# EAGLE design GPIO (EAGLE 9.0.0)
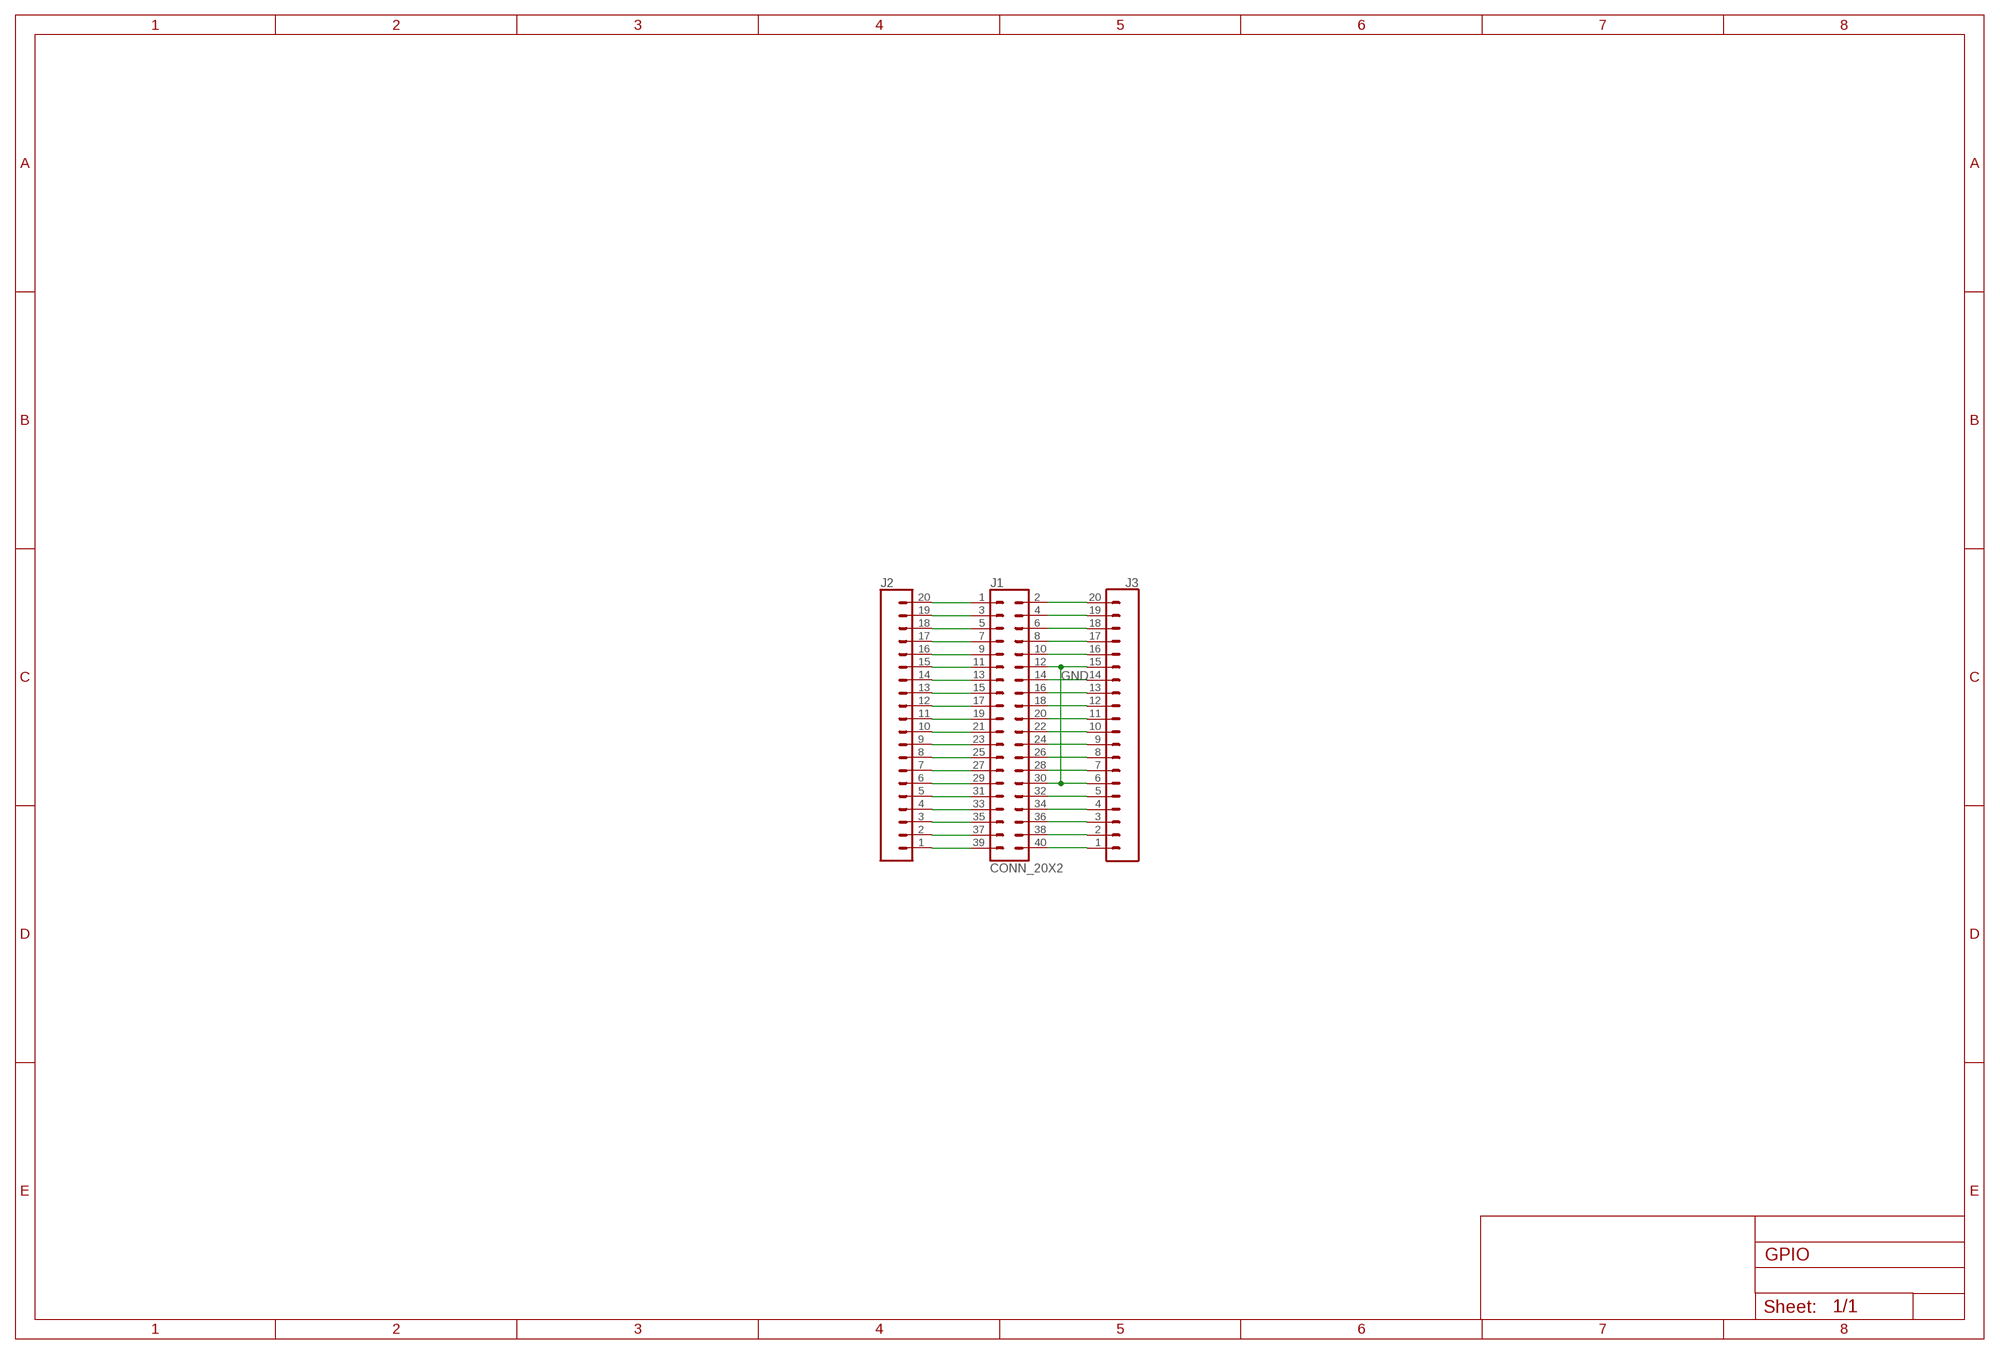
[diagram p0: schematic, sheet 1]

## Parts
J1  CONN_20X2  [2X20]
J2  CONN_20  [1X20]
J3  CONN_20  [1X20]

## Nets
GND: J1.12 J1.30 J3.6 J3.15
N$1: J1.40 J3.1
N$2: J1.38 J3.2
N$3: J1.36 J3.3
N$4: J1.34 J3.4
N$5: J1.32 J3.5
N$7: J1.28 J3.7
N$8: J1.26 J3.8
N$9: J1.24 J3.9
N$10: J1.22 J3.10
N$11: J1.20 J3.11
N$12: J1.18 J3.12
N$13: J1.16 J3.13
N$14: J1.14 J3.14
N$16: J1.10 J3.16
N$17: J1.8 J3.17
N$18: J1.6 J3.18
N$19: J1.4 J3.19
N$20: J1.2 J3.20
N$21: J1.39 J2.1
N$22: J1.37 J2.2
N$23: J1.35 J2.3
N$24: J1.33 J2.4
N$25: J1.31 J2.5
N$26: J1.29 J2.6
N$27: J1.27 J2.7
N$28: J1.25 J2.8
N$29: J1.23 J2.9
N$30: J1.21 J2.10
N$31: J1.19 J2.11
N$32: J1.17 J2.12
N$33: J1.15 J2.13
N$34: J1.13 J2.14
N$35: J1.11 J2.15
N$36: J1.9 J2.16
N$37: J1.7 J2.17
N$38: J1.5 J2.18
N$39: J1.3 J2.19
N$40: J1.1 J2.20

## Library data of the parts
J1 = SparkFun-Connectors:CONN_20X2: Multi connection point. Often used as Generic Header-pin footprint for 0.1 inch spaced/style header connections On any of the 0.1 inch spaced packages, you can populate with these: Break Away Headers - Straight <https://www.sparkfun.com/products/116> (PRT-00116) Break Away Male Headers - Right Angle <https://www.sparkfun.com/products/553> (PRT-00553) Female Headers <https://www.sparkfun.com/products/115> (PRT-00115) Break Away Headers - Machine Pin <https://www.sparkfun.com/products/117> (PRT-00117) Break Away Female Headers - Swiss Machine Pin <https://www.sparkfun.com/products/743> (PRT-00743)
J2 J3 = SparkFun-Connectors:CONN_20: Multi connection point. Often used as Generic Header-pin footprint for 0.1 inch spaced/style header connections On any of the 0.1 inch spaced packages, you can populate with these: Break Away Headers - Straight <https://www.sparkfun.com/products/116> (PRT-00116) Break Away Male Headers - Right Angle <https://www.sparkfun.com/products/553> (PRT-00553) Female Headers <https://www.sparkfun.com/products/115> (PRT-00115) Break Away Headers - Machine Pin <https://www.sparkfun.com/products/117> (PRT-00117) Break Away Female Headers - Swiss Machine Pin <https://www.sparkfun.com/products/743> (PRT-00743) For SCREWTERMINALS and SPRING TERMINALS visit here: Screw Terimnals on SparkFun.com <https://www.sparkfun.com/search/results?term=Screw+Terminals> (5mm/3.5mm/2.54mm spacing) This device is also useful as a general connection point to wire up your design to another part of your project. Our various solder wires solder well into these plated through hole pads. Hook-Up Wire - Assortment (Stranded, 22 AWG) <https://www.sparkfun.com/products/11375> (PRT-11375) Hook-Up Wire - Assortment (Solid Core, 22 AWG) <https://www.sparkfun.com/products/11367> (PRT-11367) View the entire wire category on our website here <https://www.sparkfun.com/categories/141> Special notes: Molex polarized connector foot print use with SKU : PRT-08231 with associated crimp pins and housings. 1MM SMD Version SKU: PRT-10208 NOTES ON THE VARIANTS LOCK and LOCK_LONGPADS... This footprint was designed to help hold the alignment of a through-hole component (i.e. 6-pin header) while soldering it into place. You may notice that each hole has been shifted either up or down by 0.005 of an inch from it's more standard position (which is a perfectly straight line). This slight alteration caused the pins (the squares in the middle) to touch the edges of the holes. Because they are alternating, it causes a "brace" to hold the component in place. 0.005 has proven to be the perfect amount of "off-center" position when using our standard breakaway headers. Although looks a little odd when you look at the bare footprint, once you have a header in there, the alteration is very hard to notice. Also,if you push a header all the way into place, it is covered up entirely on the bottom side. Note about LOCK SPECIAL package: This is just like the LOCK variant in that the holes are staggared by 5 mil, but except for the last two holes. They are not altered from the "standard" footprint layout. This is used for a special purpose on the layout of our Graphic LCD Backpack. Make sure you want to use this device before selecting it for you project!

## Net classes
0 default: width 0.794 mm, drill 1.587 mm, clearance 0.58 mm

## Board
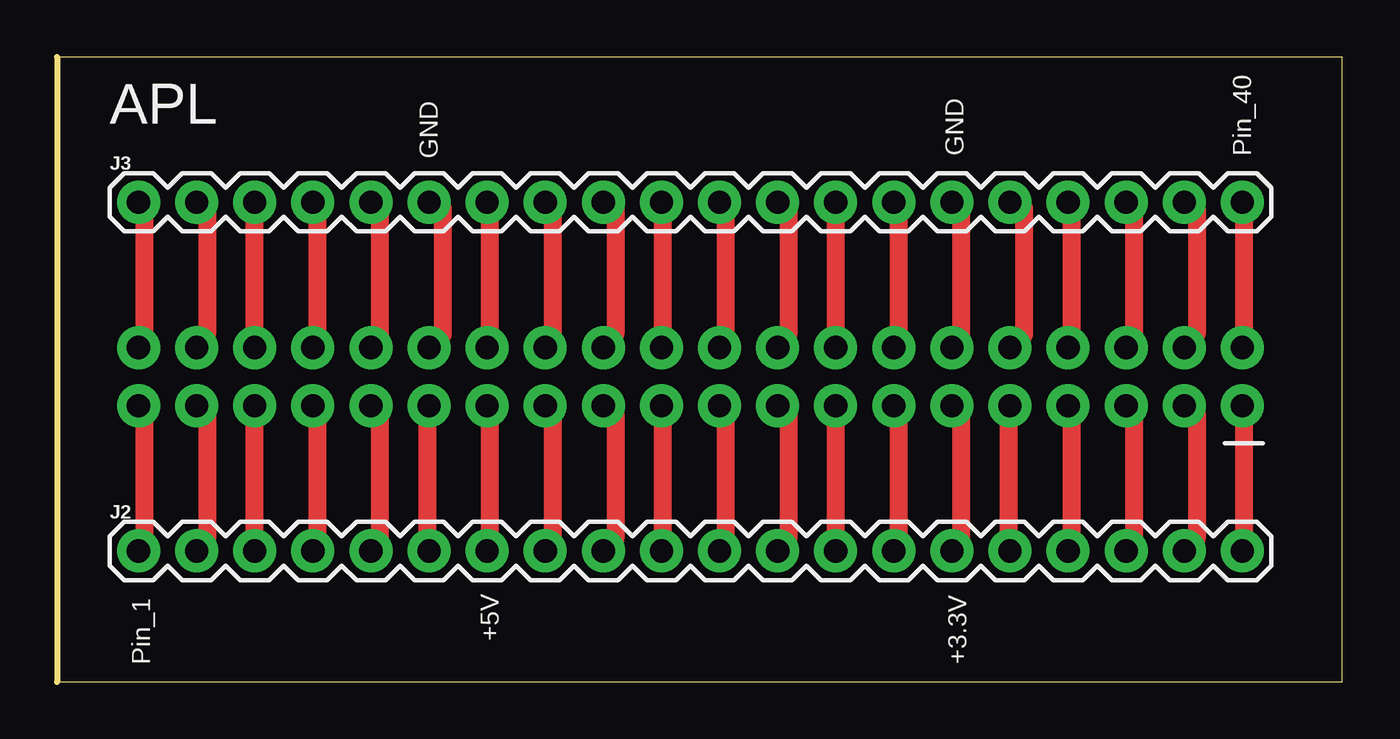
[diagram p1: board, top side]
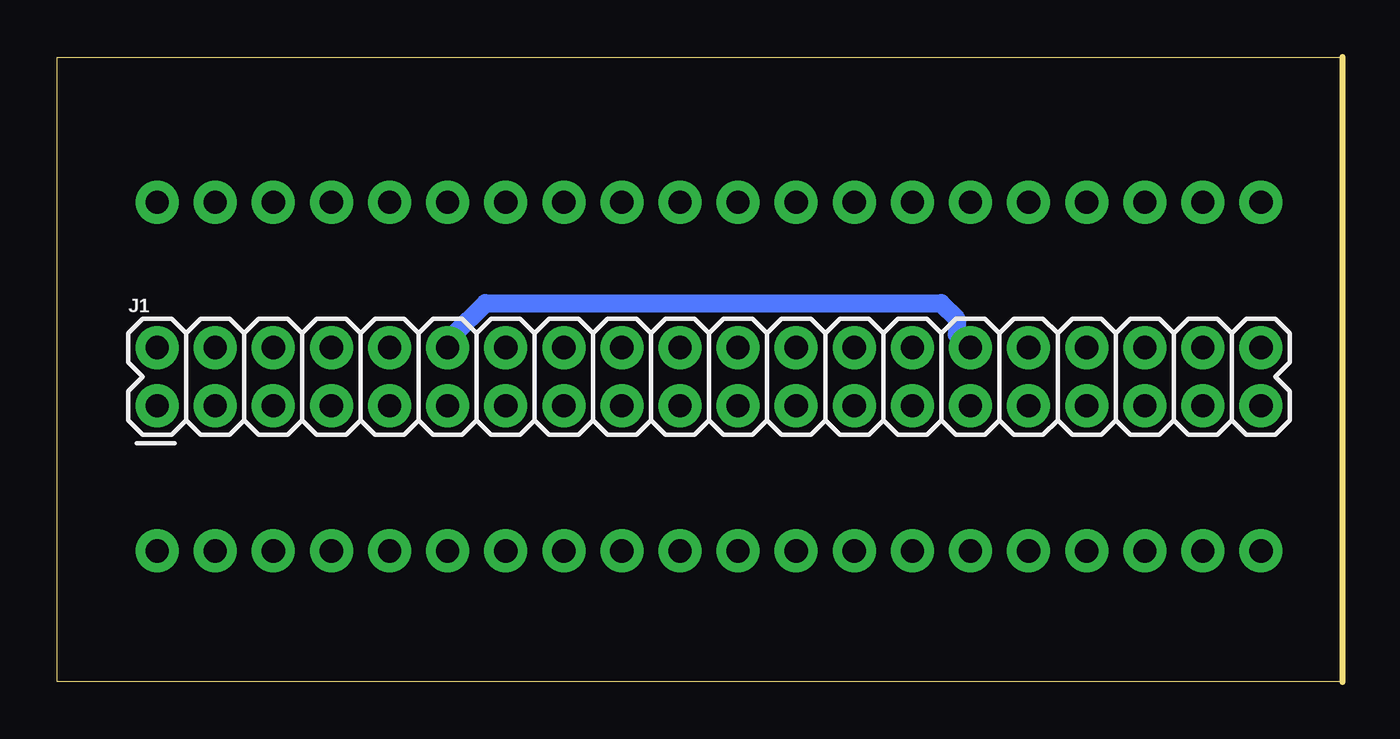
[diagram p2: board, bottom side, seen from below]

Size 56.19 x 27.3 mm. Coordinates in mm from the lower left corner, seen from the top.
Outline: 0,0 56.19,0 56.19,27.3 0,27.3 0,0
Copper layers (1*16): Top 0.035559375mm / dielectric 1.6mm / Bottom 0.035559375mm
Design rules "oshpark-2layer-auto-routing": minimum track width 10mil, minimum drill 10mil, track to track 10mil, track to pad 8mil, pad to pad 8mil, via to via 8mil, smd to smd 6mil, copper to edge 15mil, drill to drill 6mil, minimum pad ring 6mil, minimum via ring 6mil, stop-mask expansion 2.5mil, vias tented up to drill 0mil, thermal gap 10mil

### Footprints (pad centres in the part's own frame; a part is rotated, then mirrored left to right if it is on the bottom)
2X20 = drill 1.016 pad 1.88: 1 0,0; 2 0,2.54; 3 2.54,0; 4 2.54,2.54; 5 5.08,0; 6 5.08,2.54; 7 7.62,0; 8 7.62,2.54; 9 10.16,0; 10 10.16,2.54; 11 12.7,0; 12 12.7,2.54; 13 15.24,0; 14 15.24,2.54; 15 17.78,0; 16 17.78,2.54; 17 20.32,0; 18 20.32,2.54; 19 22.86,0; 20 22.86,2.54; 21 25.4,0; 22 25.4,2.54; 23 27.94,0; 24 27.94,2.54; 25 30.48,0; 26 30.48,2.54; 27 33.02,0; 28 33.02,2.54; 29 35.56,0; 30 35.56,2.54; 31 38.1,0; 32 38.1,2.54; 33 40.64,0; 34 40.64,2.54; 35 43.18,0; 36 43.18,2.54; 37 45.72,0; 38 45.72,2.54; 39 48.26,0; 40 48.26,2.54
1X20 = drill 1.016 pad 1.88: 1 0,0; 2 2.54,0; 3 5.08,0; 4 7.62,0; 5 10.16,0; 6 12.7,0; 7 15.24,0; 8 17.78,0; 9 20.32,0; 10 22.86,0; 11 25.4,0; 12 27.94,0; 13 30.48,0; 14 33.02,0; 15 35.56,0; 16 38.1,0; 17 40.64,0; 18 43.18,0; 19 45.72,0; 20 48.26,0

### Placement (x,y rotation side)
J1  51.82,12.06 0 bottom
J2  3.56,5.71 0 top
J3  3.56,20.95 0 top
U$1  [A3L-LOC]  -152.91,-106.43 0 top  (outside the outline)

### Tracks (layer width: path | path; a pad name or v marks a point on that pad's centre or on a via)
GND
  Top 0.794: J1.30 16.85,15.18 16.85,20.67 J3.6 | J1.12 39.52,15.18 39.52,20.67 J3.15
  Bottom 0.794: J1.30 16.85,15.18 16.85,15.86 17.54,16.55 37.46,16.55 38.83,15.18 J1.12
N$1
  Top 0.794: J1.40 3.8,15.18 3.8,20.67 J3.1
N$2
  Top 0.794: J1.38 6.55,15.18 6.55,20.67 J3.2
N$3
  Top 0.794: J1.36 8.61,15.18 8.61,20.67 J3.3
N$4
  Top 0.794: J1.34 11.36,15.18 11.36,20.67 J3.4
N$5
  Top 0.794: J1.32 14.11,15.18 14.11,20.67 J3.5
N$7
  Top 0.794: J1.28 18.91,15.18 18.91,20.67 J3.7
N$8
  Top 0.794: J1.26 21.66,15.18 21.66,20.67 J3.8
N$9
  Top 0.794: J1.24 24.41,15.18 24.41,20.67 J3.9
N$10
  Top 0.794: J1.22 26.47,15.18 26.47,20.67 J3.10
N$11
  Top 0.794: J1.20 29.22,15.18 29.22,20.67 J3.11
N$12
  Top 0.794: J1.18 31.96,15.18 31.96,20.67 J3.12
N$13
  Top 0.794: J1.16 34.02,15.18 34.02,20.67 J3.13
N$14
  Top 0.794: J1.14 36.77,15.18 36.77,20.67 J3.14
N$16
  Top 0.794: J1.10 42.27,15.18 42.27,20.67 J3.16
N$17
  Top 0.794: J1.8 44.33,15.18 44.33,20.67 J3.17
N$18
  Top 0.794: J1.6 47.08,15.18 47.08,20.67 J3.18
N$19
  Top 0.794: J1.4 49.82,15.18 49.82,20.67 J3.19
N$20
  Top 0.794: J1.2 51.88,15.18 51.88,20.67 J3.20
N$21
  Top 0.794: J2.1 3.8,6.25 3.8,11.74 J1.39
N$22
  Top 0.794: J2.2 6.55,6.25 6.55,11.74 J1.37
N$23
  Top 0.794: J2.3 8.61,6.25 8.61,11.74 J1.35
N$24
  Top 0.794: J2.4 11.36,6.25 11.36,11.74 J1.33
N$25
  Top 0.794: J2.5 14.11,6.25 14.11,11.74 J1.31
N$26
  Top 0.794: J2.6 16.17,6.25 16.17,11.74 J1.29
N$27
  Top 0.794: J2.7 18.91,6.25 18.91,11.74 J1.27
N$28
  Top 0.794: J2.8 21.66,6.25 21.66,11.74 J1.25
N$29
  Top 0.794: J2.9 24.41,6.25 24.41,11.74 J1.23
N$30
  Top 0.794: J2.10 26.47,6.25 26.47,11.74 J1.21
N$31
  Top 0.794: J2.11 29.22,6.25 29.22,11.74 J1.19
N$32
  Top 0.794: J2.12 31.96,6.25 31.96,11.74 J1.17
N$33
  Top 0.794: J2.13 34.02,6.25 34.02,11.74 J1.15
N$34
  Top 0.794: J2.14 36.77,6.25 36.77,11.74 J1.13
N$35
  Top 0.794: J2.15 39.52,6.25 39.52,11.74 J1.11
N$36
  Top 0.794: J2.16 41.58,6.25 41.58,11.74 J1.9
N$37
  Top 0.794: J2.17 44.33,6.25 44.33,11.74 J1.7
N$38
  Top 0.794: J2.18 47.08,6.25 47.08,11.74 J1.5
N$39
  Top 0.794: J2.19 49.82,6.25 49.82,11.74 J1.3
N$40
  Top 0.794: J2.20 51.88,6.25 51.88,11.74 J1.1

### Text on the board
tPlace: APL | GND | GND | Pin_40 | +5V | Pin_1 | +3.3V